# Altium schematic sheet Sheet3.SchDoc
size A; DocumentNumber: 9; SheetNumber: 7; SheetTotal: 9
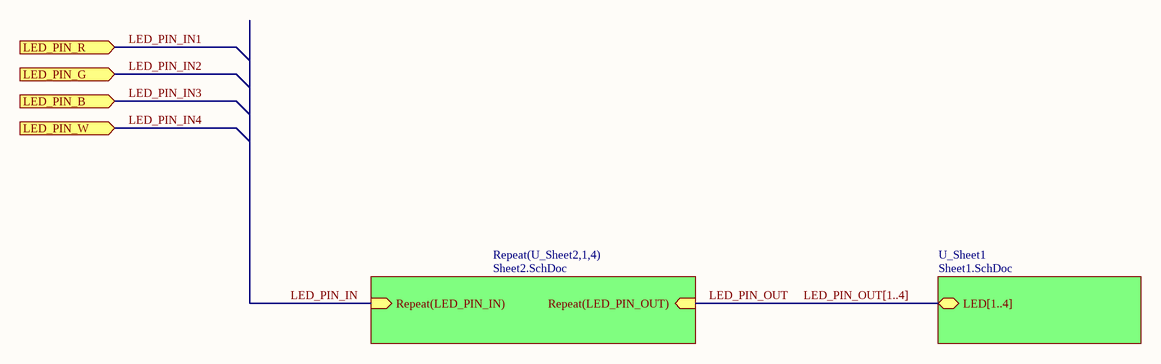
[diagram p0: Sheet3.SchDoc]

## Sub-sheets
Repeat(U_Sheet2,1,4) = Sheet2.SchDoc: Repeat(LED_PIN_IN) (in), Repeat(LED_PIN_OUT) (in)
U_Sheet1 = Sheet1.SchDoc: LED[1..4] (bidir)

## Ports
LED_PIN_B (in), LED_PIN_G (in), LED_PIN_R (in), LED_PIN_W (in)

## Nets
LED_PIN_IN: sheet Repeat(U_Sheet2,1,4)/Repeat(LED_PIN_IN)
LED_PIN_IN1: port LED_PIN_R
LED_PIN_IN2: port LED_PIN_G
LED_PIN_IN3: port LED_PIN_B
LED_PIN_IN4: port LED_PIN_W
LED_PIN_OUT: sheet Repeat(U_Sheet2,1,4)/Repeat(LED_PIN_OUT)

## Buses and harness runs
bus LED_PIN_OUT[1..4] = sheet U_Sheet1/LED[1..4]